# Altium schematic sheet MAZ000156 - Diagrama eléctrico.SchDoc: MAZ000156 - Diagrama eléctrico
size A; ApprovedBy: Christian Ledwidth; CheckedBy: Nahuel Martinez; Author: Santiago Marti; CompanyName: Body Health; DrawnBy: Santiago Marti; Revision: A; SheetNumber: 1; SheetTotal: 2
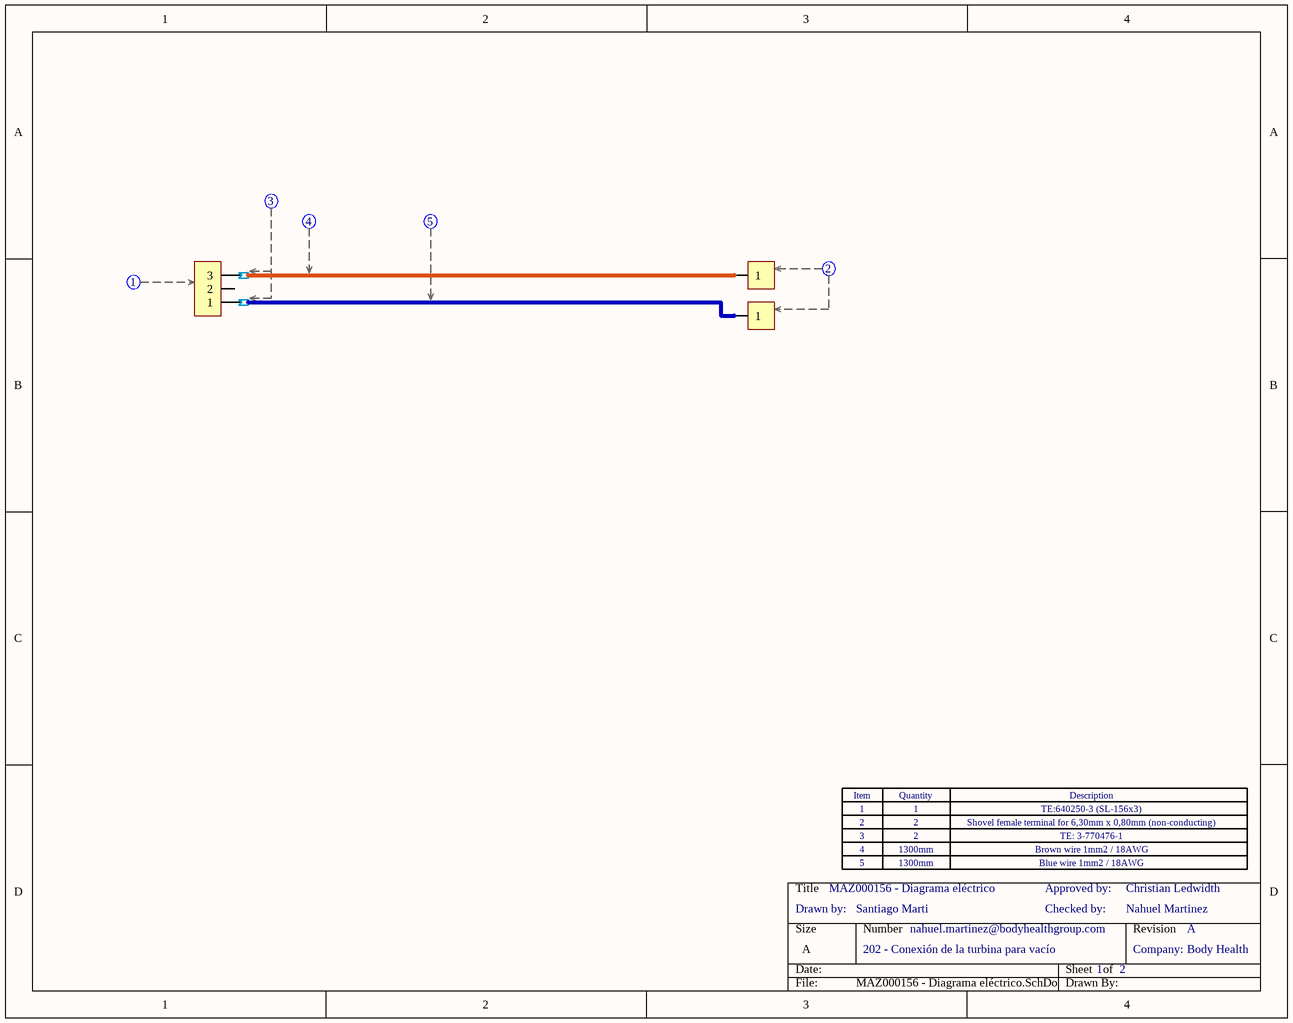
[diagram p0: MAZ000156 - Diagrama eléctrico.SchDoc]

## Parts
(Parts that share a designator on the sheet are numbered #1, #2 ... from top to bottom, then left to right.)
Con1  SL156-3  (value not drawn)  (parts C,D of 4)
Con2  SL156-3  (value not drawn)  (part C of 4)
Con3  SL156-3  (value not drawn)  (part C of 4)
Con?#1  Ring  (value not drawn)  (part D of 4)
Con?#2  Ring  (value not drawn)  (part D of 4)
Soc1  sock_SL156_770476-1  (value not drawn)  (parts A,B of 2)
Soc2  sock_SL156_770476-1  (value not drawn)  (part B of 2)
Soc?  sock_SL156_770476-1  (value not drawn)  (part A of 2)
Zoc1  Zócalo_Header  (value not drawn)
Zoc2  Zócalo_Item  (value not drawn)
Zoc3  Zócalo_Item  (value not drawn)
Zoc4  Zócalo_Item  (value not drawn)
Zoc5  Zócalo_Item  (value not drawn)
Zoc?  Zócalo_Item  (value not drawn)

## Nets
NetCon1_1: Con1.1 Soc2.0
NetCon1_3: Con1.3 Soc1.0
NetCon?#1_1: Con?#1.1 Soc1.1
NetCon?#2_1: Con?#2.1 Soc2.1

Not connected (* = marked no-connect by the designer): Con1 2

## Notes on the sheet
- 1
- 3
- 2
- TE:640250-3 (SL-156x3)
- TE: 3-770476-1
- Shovel female terminal for 6,30mm x 0,80mm (non-conducting)
- Drawn by:
- 4
- 5
- 1300mm
- Checked by:
- Approved by:
- Brown wire 1mm2 / 18AWG
- Blue wire 1mm2 / 18AWG
- 202 - Conexión de la turbina para vacío
- nahuel.martinez@bodyhealthgroup.com
- Company:
- (in symbol Zócalo_Header) Item; Quantity; Description

## Library data of the parts
Con1 = SL156-3: CONN RECEPT 3 POS W/RAMP SL-156; Cod.Fabricante: 640250-3; Fabricante: TE Connectivity AMP Connectors; CallOut: 4; Cod.DigiKey: A19951-ND; ComponentLink1Description: Manufacturer Link; ComponentLink1URL: https://www.te.com/commerce/DocumentDelivery/DDEController?Action=srchrtrv&DocNm=640250&DocType=Customer+Drawing&DocLang=English; DIGIKEYx50: 0.14460; DIGIKEYx100: 0.13430
Con2 = SL156-3: CONN RECEPT 3 POS W/RAMP SL-156; Cod.Fabricante: 640250-3; Fabricante: TE Connectivity AMP Connectors; CallOut: 5; Cod.DigiKey: A19951-ND; ComponentLink1Description: Manufacturer Link; ComponentLink1URL: https://www.te.com/commerce/DocumentDelivery/DDEController?Action=srchrtrv&DocNm=640250&DocType=Customer+Drawing&DocLang=English; DIGIKEYx50: 0.14460; DIGIKEYx100: 0.13430
Con3 = SL156-3: CONN RECEPT 3 POS W/RAMP SL-156; Cod.Fabricante: 640250-3; Fabricante: TE Connectivity AMP Connectors; CallOut: 1; Cod.DigiKey: A19951-ND; ComponentLink1Description: Manufacturer Link; ComponentLink1URL: https://www.te.com/commerce/DocumentDelivery/DDEController?Action=srchrtrv&DocNm=640250&DocType=Customer+Drawing&DocLang=English; DIGIKEYx50: 0.14460; DIGIKEYx100: 0.13430
Con?#1 Con?#2 = Ring: CONN HOUSING RING M4; Cod.DigiKey: -; Cod.Fabricante: -; ComponentLink1Description: Manufacturer Link; ComponentLink1URL: -; DIGIKEYx50: -; Fabricante: -; CallOut: *; DIGIKEYx100: -
Soc1 = sock_SL156_770476-1: CONN SOCKET 18-24AWG CRIMP TIN; Fabricante: TE Connectivity AMP Connectors; CallOut: 3; Cod.DigiKey: A19993CT-ND; Cod.Fabricante: 770476-1; ComponentLink1Description: Manufacturer Link; ComponentLink1URL: https://www.te.com/commerce/DocumentDelivery/DDEController?Action=srchrtrv&DocNm=770476&DocType=Customer+Drawing&DocLang=English; DIGIKEYx100: 0.08690; DIGIKEYx50: 0.08180
Soc2 = sock_SL156_770476-1: CONN SOCKET 18-24AWG CRIMP TIN; Fabricante: TE Connectivity AMP Connectors; Cod.DigiKey: A19993CT-ND; Cod.Fabricante: 770476-1; ComponentLink1Description: Manufacturer Link; ComponentLink1URL: https://www.te.com/commerce/DocumentDelivery/DDEController?Action=srchrtrv&DocNm=770476&DocType=Customer+Drawing&DocLang=English; DIGIKEYx100: 0.08690; CallOut: *; DIGIKEYx50: 0.08180
Soc? = sock_SL156_770476-1: CONN SOCKET 18-24AWG CRIMP TIN; Fabricante: TE Connectivity AMP Connectors; CallOut: 2; Cod.DigiKey: A19993CT-ND; Cod.Fabricante: 770476-1; ComponentLink1Description: Manufacturer Link; ComponentLink1URL: https://www.te.com/commerce/DocumentDelivery/DDEController?Action=srchrtrv&DocNm=770476&DocType=Customer+Drawing&DocLang=English; DIGIKEYx100: 0.08690; DIGIKEYx50: 0.08180
Zoc1 = Zócalo_Header: Header para el zócalo de referencias
Zoc2-Zoc5 Zoc? = Zócalo_Item: Ítem para el zócalo de referencias; Desginator: *; Quantity: *; ItemDescription: *